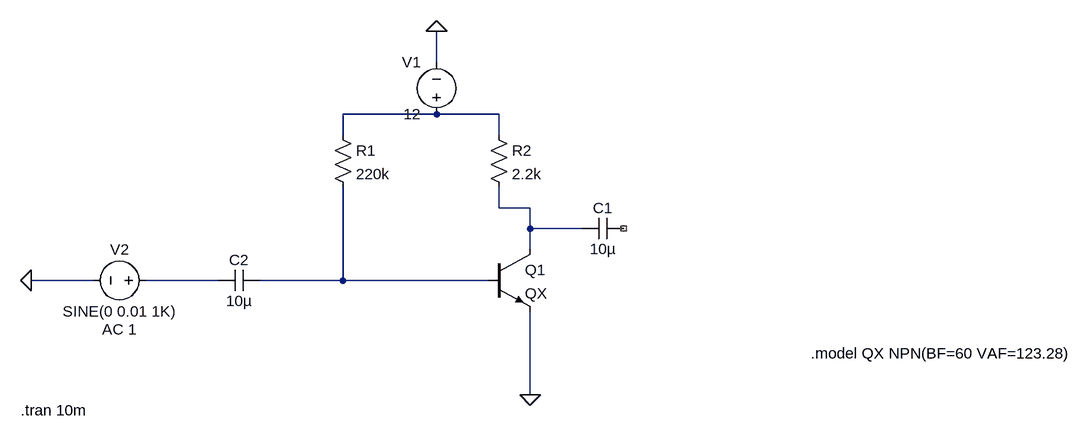
[diagram p0: schematic ejercicio simulado.asc]
ejercicio simulado.asc, the LTspice schematic file:
Version 4.1
SHEET 1 1224 688
WIRE 176 32 176 -16
WIRE 176 112 32 112
WIRE 272 112 176 112
WIRE 32 144 32 112
WIRE 272 144 272 112
WIRE 272 256 272 224
WIRE 320 256 272 256
WIRE 320 288 320 256
WIRE 400 288 320 288
WIRE 320 320 320 288
WIRE -352 368 -448 368
WIRE -160 368 -272 368
WIRE 32 368 32 224
WIRE 32 368 -96 368
WIRE 256 368 32 368
WIRE 320 544 320 416
FLAG 320 544 0
FLAG 176 -16 0
FLAG -448 368 0
SYMBOL voltage 176 128 R180
WINDOW 0 24 96 Left 2
WINDOW 3 24 16 Left 2
WINDOW 123 0 0 Left 0
WINDOW 39 0 0 Left 0
SYMATTR InstName V1
SYMATTR Value 12
SYMBOL res 16 128 R0
SYMATTR InstName R1
SYMATTR Value 220k
SYMBOL res 256 128 R0
SYMATTR InstName R2
SYMATTR Value 2.2k
SYMBOL cap 464 272 R90
WINDOW 0 0 32 VBottom 2
WINDOW 3 32 32 VTop 2
SYMATTR InstName C1
SYMATTR Value 10µ
SYMBOL cap -96 352 R90
WINDOW 0 0 32 VBottom 2
WINDOW 3 32 32 VTop 2
SYMATTR InstName C2
SYMATTR Value 10µ
SYMBOL npn 256 320 R0
SYMATTR InstName Q1
SYMATTR Value QX
SYMBOL voltage -256 368 R90
WINDOW 0 -32 56 VBottom 2
WINDOW 3 32 56 VTop 2
WINDOW 123 60 56 VTop 2
WINDOW 39 0 0 Left 0
SYMATTR InstName V2
SYMATTR Value SINE(0 0.01 1K)
SYMATTR Value2 AC 1
TEXT 752 480 Left 2 !.model QX NPN(BF=60 VAF=123.28)
TEXT -464 568 Left 2 !.tran 10m

The netlist it stands for:
* ejercicio simulado.asc
V1 N001 0 12
R1 N001 N004 220k
R2 N001 N002 2.2k
C1 NC_01 N002 10µ
C2 N004 N003 10µ
Q1 N002 N004 0 0 QX
V2 N003 0 SINE(0 0.01 1K) AC 1
.model NPN NPN
.model PNP PNP
.lib standard.bjt
.model QX NPN(BF=60 VAF=123.28)
.tran 10m
.backanno
.end